# Altium schematic sheet Sch.SchDoc
size A4
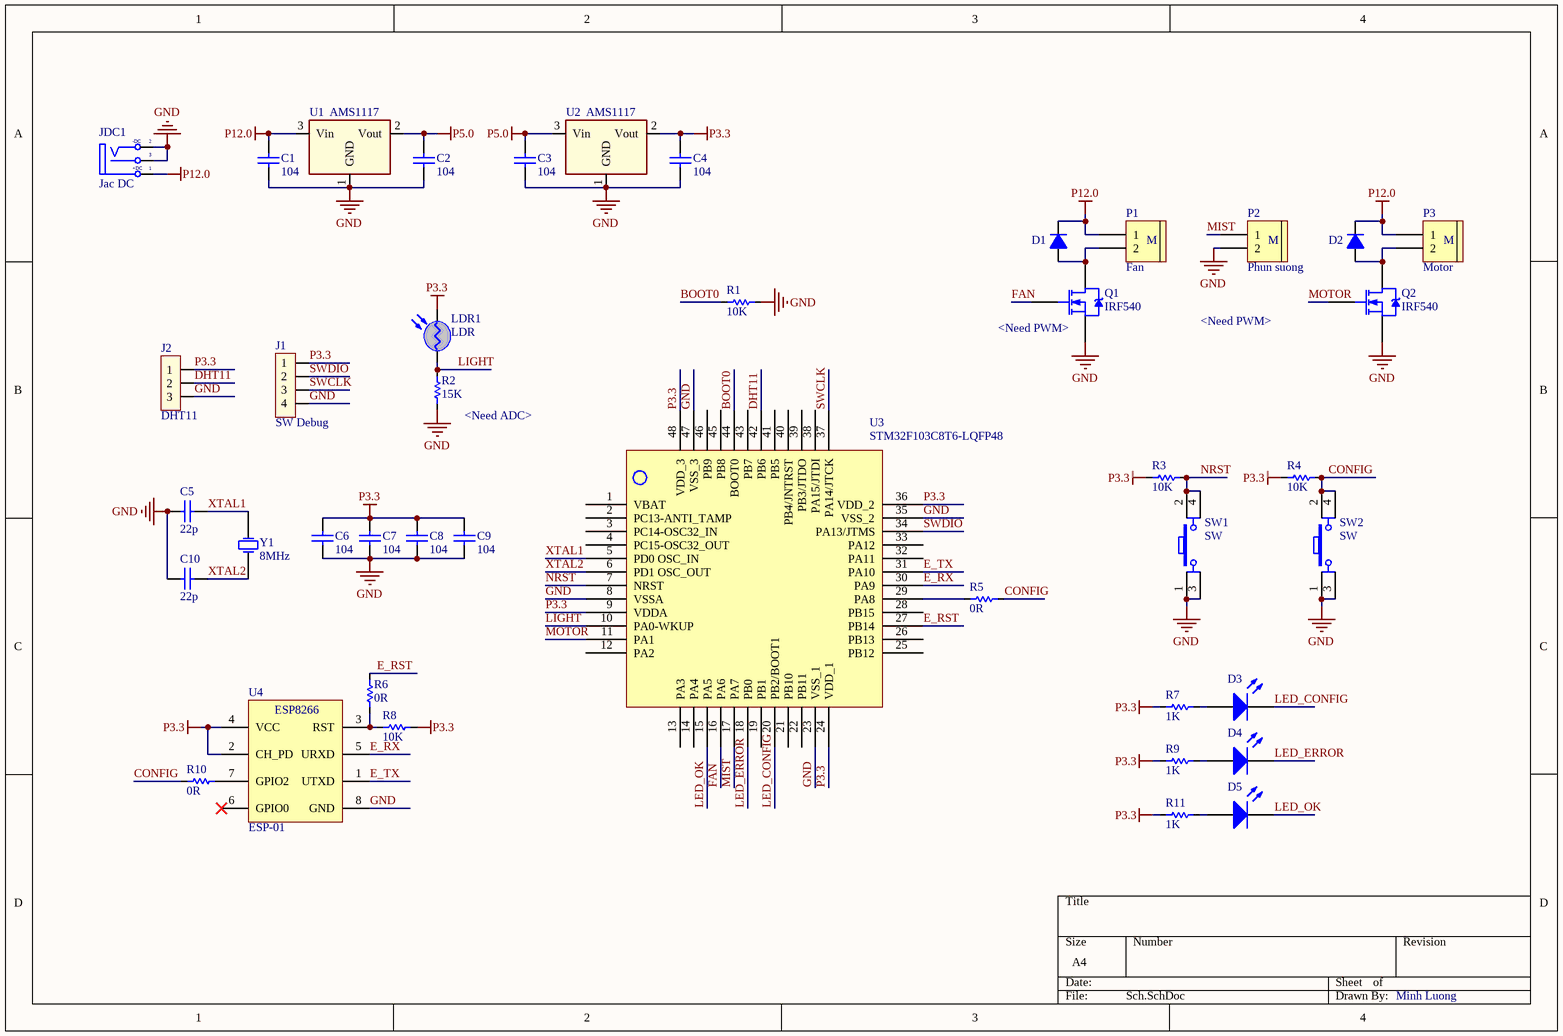
[diagram p0: Sch.SchDoc]

## Parts
C1  value 104  [CAP_SMD_0805]  (hidden comment: Cap Non-pol)
C2  value 104  [CAP_SMD_0805]  (hidden comment: Cap Non-pol)
C3  value 104  [CAP_SMD_0805]  (hidden comment: Cap Non-pol)
C4  value 104  [CAP_SMD_0805]  (hidden comment: Cap Non-pol)
C5  value 22p  [CAP_SMD_0805]  (hidden comment: Cap Non-pol)
C6  value 104  [CAP_SMD_0805]  (hidden comment: Cap Non-pol)
C7  value 104  [CAP_SMD_0805]  (hidden comment: Cap Non-pol)
C8  value 104  [CAP_SMD_0805]  (hidden comment: Cap Non-pol)
C9  value 104  [CAP_SMD_0805]  (hidden comment: Cap Non-pol)
C10  value 22p  [CAP_SMD_0805]  (hidden comment: Cap Non-pol)
D1  Diode  [DO-41]  (value not drawn)
D2  Diode  [DO-41]  (value not drawn)
D3  LED  [LED-0805 BLUE]  (value not drawn)
D4  LED  [LED-0805 RED]  (value not drawn)
D5  LED  [LED-0805 GREEN]  (value not drawn)
J1  SW Debug  [CON.HDR1X4]
J2  DHT11  [JP3]
JDC1  Jac DC  [DC-IN]
LDR1  LDR  [CDS]
P1  Fan  [Medium - Header 2]
P2  Phun suong  [Medium - Header 2]
P3  Motor  [Medium - Header 2]
Q1  IRF540  [TO-220-3]
Q2  IRF540  [TO-220-3]
R1  value 10K  [RES_SMD_0805]  (hidden comment: RESISTOR)
R2  value 15K  [RES_SMD_0805]  (hidden comment: RESISTOR)
R3  value 10K  [RES_SMD_0805]  (hidden comment: RESISTOR)
R4  value 10K  [RES_SMD_0805]  (hidden comment: RESISTOR)
R5  value 0R  [RES_SMD_0805]  (hidden comment: RESISTOR)
R6  value 0R  [RES_SMD_0805]  (hidden comment: RESISTOR)
R7  value 1K  [RES_SMD_0805]  (hidden comment: RESISTOR)
R8  value 10K  [RES_SMD_0805]  (hidden comment: RESISTOR)
R9  value 1K  [RES_SMD_0805]  (hidden comment: RESISTOR)
R10  value 0R  [RES_SMD_0805]  (hidden comment: RESISTOR)
R11  value 1K  [RES_SMD_0805]  (hidden comment: RESISTOR)
SW1  SW  [SW4]
SW2  SW  [SW4]
U1  AMS1117  [SOT223]
U2  AMS1117  [SOT223]
U3  STM32F103C8T6-LQFP48  [TQFP48L]
U4  ESP-01  [ESP8266]
Y1  8MHz  [XTAL]

## Nets
GND: C1.1 C2.1 C3.1 C4.1 C5.1 C6.1 C7.1 C8.1 C9.1 C10.1 J1.4 J2.3 JDC1.2(TN) JDC1.3(S) P2.2 Q1.3(S) Q2.3(S) R1.2 R2.2 SW1.1 SW1.3 SW2.1 SW2.3 U1.1(GND) U2.1(GND) U3.8(VSSA) U3.23(VSS_1) U3.35(VSS_2) U3.47(VSS_3) U4.8(GND)
P3.3: C4.2 C6.2 C7.2 C8.2 C9.2 J1.1 J2.1 LDR1.2(K) R3.2 R4.2 R7.2 R8.1 R9.2 R11.2 U2.2(Vout) U3.9(VDDA) U3.24(VDD_1) U3.36(VDD_2) U3.48(VDD_3) U4.2(CH_PD) U4.4(VCC)
P5.0: C2.2 C3.2 U1.2(Vout) U2.3(Vin)
P12.0: C1.2 D1.2(K) D2.2(K) JDC1.1(T) P1.1 P3.1 U1.3(Vin)
BOOT0: R1.1 U3.44(BOOT0)
CONFIG: R4.1 R5.1 R10.1 SW2.2 SW2.4
DHT11: J2.2 U3.42(PB6)
E_RST: R6.1 U3.27(PB14)
E_RX: U3.30(PA9) U4.5(URXD)
E_TX: U3.31(PA10) U4.1(UTXD)
FAN: Q1.1(G) U3.16(PA6)
LED_CONFIG: D3.2(K) U3.20(PB2/BOOT1)
LED_ERROR: D4.2(K) U3.18(PB0)
LED_OK: D5.2(K) U3.15(PA5)
LIGHT: LDR1.1(A) R2.1 U3.10(PA0-WKUP)
MIST: P2.1 U3.17(PA7)
MOTOR: Q2.1(G) U3.11(PA1)
NRST: R3.1 SW1.2 SW1.4 U3.7(NRST)
SWCLK: J1.3 U3.37(PA14/JTCK)
SWDIO: J1.2 U3.34(PA13/JTMS)
XTAL1: C5.2 U3.5(PD0_OSC_IN) Y1.2(OSC2)
XTAL2: C10.2 U3.6(PD1_OSC_OUT) Y1.1(OSC1)
NetD1_1: D1.1(A) P1.2 Q1.2(D)
NetD2_1: D2.1(A) P3.2 Q2.2(D)
NetD3_1: D3.1(A) R7.1
NetD4_1: D4.1(A) R9.1
NetD5_1: D5.1(A) R11.1
NetR5_2: R5.2 U3.29(PA8)
NetR6_2: R6.2 R8.2 U4.3(RST)
NetR10_2: R10.2 U4.7(GPIO2)

Not connected (* = marked no-connect by the designer): U3 1(VBAT) 2(PC13-ANTI_TAMP) 3(PC14-OSC32_IN) 4(PC15-OSC32_OUT) 12(PA2) 13(PA3) 14(PA4) 19(PB1) 21(PB10) 22(PB11) 25(PB12) 26(PB13) 28(PB15) 32(PA11) 33(PA12) 38(PA15/JTDI) 39(PB3/JTDO) 40(PB4/JNTRST) 41(PB5) 43(PB7) 45(PB8) 46(PB9); U4 6(GPIO0)*

## Notes on the sheet
- (near Q1) <Need PWM>
- <Need PWM>
- (near R2) <Need ADC>
- Minh Luong
- (in symbol DCIN) -DC; +DC
- (in symbol ESP8266-01) ESP8266
- (in symbol Header 2 - M) M

## Library data of the parts
C1-C10 = Cap Non-pol: Non-polarized Capacitor; LatestRevisionNote: Re-released for DXP Platform.; PackageReference: RAD-0.3; Publisher: Altium Limited
D1 D2 = Diode: Vendor: Digikey; Value: FRxxx; Published: 8-Jun-2000; LatestRevisionDate: 17-Jul-2002; LatestRevisionNote: Re-released for DXP Platform.; DatasheetDocument: 1997; PackageReference: DO-35; Publisher: Altium Limited; Code_JEDEC: DO-204-AH; ComponentLink1Description: Digikey Part Link; ComponentLink1URL: http://www.fairchildsemi.com/; ComponentLink2Description: Open Datasheet; ComponentLink2URL: H:\LIBRARY\LIBRARY.Datasheet\ds26003.pdf
D3-D5 = LED: Typical LED; Published: 8-Jun-2000; LatestRevisionDate: 08-Jul-2005; LatestRevisionNote: Mech Layer 1 removed.; PackageReference: LED-1; Publisher: Altium Limited
J1 = JP4
J2 = JP3: Jumper 3; Value: J3
JDC1 = DCIN: Jac DC input; Value: Jac DC
LDR1 = LDR: Quang Tro
P1-P3 = Header 2 - M: Header, 2-Pin, Medium; LatestRevisionDate: 17-Jul-2002; LatestRevisionNote: Re-released for DXP Platform.; Publisher: Altium Limited
Q1 Q2 = IRF540: HEXFET N-Channel Power MOSFET; Note: Pin 2 is electrically connected to pin 4.; Published: 8-Jun-2000; LatestRevisionDate: 17-Jul-2002; LatestRevisionNote: Re-released for DXP Platform.; DatasheetVersion: PD-9.373H; PackageVersion: Feb-1997; PackageReference: TO-220AB; Publisher: Altium Limited; PackageDescription: TO, Thru-Hole, Vertical, Heatsink Mounted; 3 In-Line Leads; Pitch 2.54 mm; ComponentLink1Description: Manufacturer Link; ComponentLink1URL: http://www.irf.com/
SW1 SW2 = SW4: Switch button 4 pin; Value: Button chip 4 pin
U1 U2 = AMS1117: Regulator SMD Chip; Designed By: John MacTavish; Vendor: Digikey; ComponentLink1Description: Digikey Part Link; ComponentLink2Description: Open Datasheet; ComponentLink2URL: H:\LIBRARY\LIBRARY.Datasheet\
U4 = ESP8266-01: ESP-12 Wi-Fi Module
Y1 = XTAL: Crystal Oscillator; Published: 8-Jun-2000; LatestRevisionDate: 17-Jul-2002; LatestRevisionNote: Re-released for DXP Platform.; PackageReference: R38; Publisher: Altium Limited
R1-R11 = RESISTOR: Published: 8-Jun-2000; LatestRevisionDate: 17-Jul-2002; LatestRevisionNote: Re-released for DXP Platform.; PackageReference: AXIAL-0.3; Publisher: Altium Limited
U3 = STM32F103C8T6-LQFP48: Published: 30-May-2008; DatasheetVersion: rev6, Mar-2008; PackageVersion: Mar-2008; PackageReference: LQFP48; Publisher: Altium Limited; PackageDescription: 48-Pin Low-Profile Quad Flat Pack, 7 x 7 mm Body, 0.5 mm Pitch (LQFP48); ComponentLink1Description: Manufacturer Link; ComponentLink1URL: www.st.com/stm32; ComponentLink2Description: Datasheet; ComponentLink2URL: http://www.st.com/stonline/products/literature/ds/13586.pdf